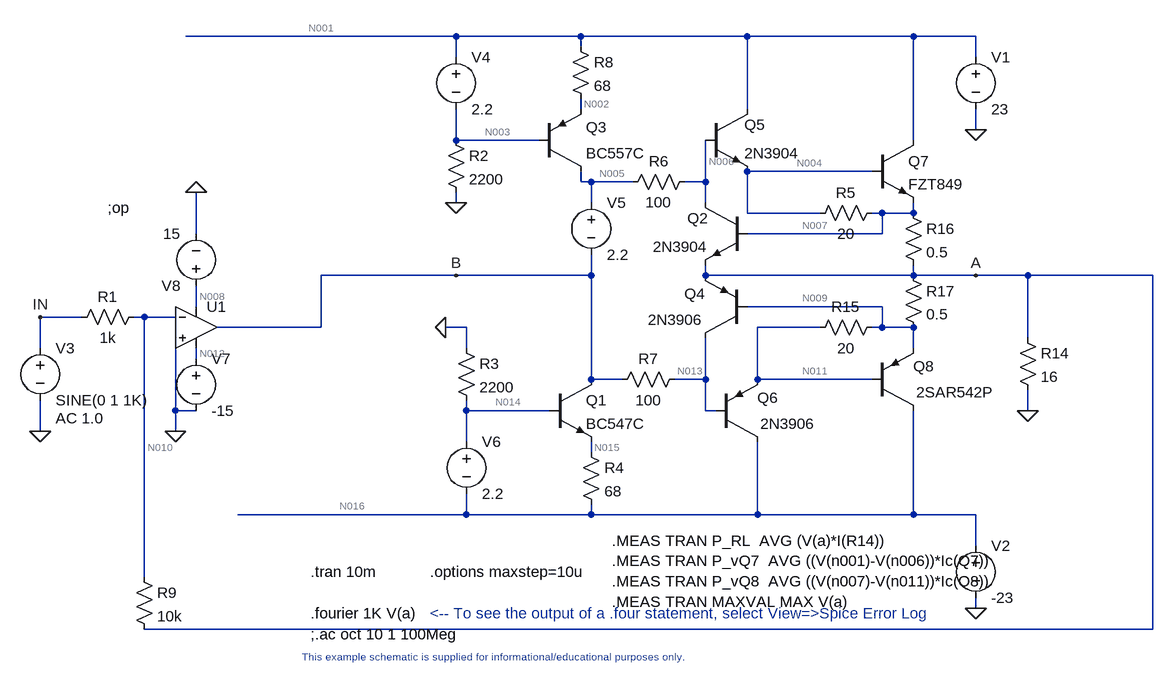
[diagram p0: schematic audioampFH2OP.asc]
audioampFH2OP.asc, the LTspice schematic file:
Version 4
SHEET 1 2516 2032
WIRE 1200 928 784 928
WIRE 1392 928 1200 928
WIRE 1648 928 1392 928
WIRE 1904 928 1648 928
WIRE 2000 928 1904 928
WIRE 1392 944 1392 928
WIRE 1200 960 1200 928
WIRE 2000 960 2000 928
WIRE 1392 1040 1392 1024
WIRE 1648 1040 1648 928
WIRE 2000 1072 2000 1040
WIRE 1200 1088 1200 1040
WIRE 1328 1088 1200 1088
WIRE 1904 1088 1904 928
WIRE 1840 1136 1648 1136
WIRE 1392 1152 1392 1136
WIRE 1408 1152 1392 1152
WIRE 1472 1152 1408 1152
WIRE 1584 1152 1584 1088
WIRE 1584 1152 1552 1152
WIRE 1200 1184 1200 1168
WIRE 1408 1184 1408 1152
WIRE 1584 1184 1584 1152
WIRE 1648 1200 1648 1136
WIRE 1760 1200 1648 1200
WIRE 1856 1200 1840 1200
WIRE 1904 1200 1904 1184
WIRE 1904 1200 1856 1200
WIRE 800 1232 800 1168
WIRE 1856 1232 1856 1200
WIRE 1856 1232 1648 1232
WIRE 1200 1296 992 1296
WIRE 1408 1296 1408 1264
WIRE 1408 1296 1200 1296
WIRE 1584 1296 1584 1280
WIRE 1904 1296 1904 1280
WIRE 1904 1296 1584 1296
WIRE 2000 1296 1904 1296
WIRE 2080 1296 2000 1296
WIRE 2272 1296 2080 1296
WIRE 800 1344 800 1312
WIRE 1856 1344 1648 1344
WIRE 624 1360 560 1360
WIRE 720 1360 704 1360
WIRE 768 1360 720 1360
WIRE 992 1376 992 1296
WIRE 992 1376 832 1376
WIRE 1216 1376 1184 1376
WIRE 1760 1376 1664 1376
WIRE 1856 1376 1856 1344
WIRE 1856 1376 1840 1376
WIRE 1904 1376 1856 1376
WIRE 2080 1392 2080 1296
WIRE 560 1408 560 1360
WIRE 1216 1408 1216 1376
WIRE 1904 1408 1904 1376
WIRE 800 1424 800 1408
WIRE 1408 1456 1408 1296
WIRE 1456 1456 1408 1456
WIRE 1584 1456 1584 1392
WIRE 1584 1456 1536 1456
WIRE 1664 1456 1664 1376
WIRE 1840 1456 1664 1456
WIRE 768 1504 768 1392
WIRE 800 1504 768 1504
WIRE 1216 1504 1216 1488
WIRE 1344 1504 1216 1504
WIRE 1584 1504 1584 1456
WIRE 1600 1504 1584 1504
WIRE 2080 1504 2080 1472
WIRE 560 1536 560 1488
WIRE 768 1536 768 1504
WIRE 1216 1552 1216 1504
WIRE 1408 1568 1408 1552
WIRE 1216 1664 1216 1632
WIRE 1216 1664 864 1664
WIRE 1408 1664 1408 1648
WIRE 1408 1664 1216 1664
WIRE 1664 1664 1664 1552
WIRE 1664 1664 1408 1664
WIRE 1904 1664 1904 1504
WIRE 1904 1664 1664 1664
WIRE 2000 1664 1904 1664
WIRE 2000 1712 2000 1664
WIRE 720 1760 720 1360
WIRE 2000 1808 2000 1792
WIRE 2272 1840 2272 1296
WIRE 2272 1840 720 1840
FLAG 2000 1072 0
FLAG 2000 1808 0
FLAG 2080 1504 0
FLAG 560 1536 0
FLAG 560 1360 IN
FLAG 1200 1184 0
FLAG 1184 1376 0
FLAG 2000 1296 A
FLAG 1200 1296 B
FLAG 768 1536 0
FLAG 800 1168 0
SYMBOL NPN 1584 1040 R0
WINDOW 0 60 24 Left 2
WINDOW 3 60 68 Left 2
SYMATTR InstName Q5
SYMATTR Value 2N3904
SYMBOL npn 1840 1088 R0
SYMATTR InstName Q7
SYMATTR Value FZT849
SYMBOL PNP 1600 1552 M180
WINDOW 0 64 68 Left 2
WINDOW 3 68 28 Left 2
SYMATTR InstName Q6
SYMATTR Value 2N3906
SYMBOL VOLTAGE 2000 944 R0
WINDOW 123 0 0 Left 2
WINDOW 39 0 0 Left 2
SYMATTR InstName V1
SYMATTR Value 23
SYMBOL voltage 2000 1696 R0
WINDOW 123 0 0 Left 2
WINDOW 39 0 0 Left 2
SYMATTR InstName V2
SYMATTR Value -23
SYMBOL res 2064 1376 R0
SYMATTR InstName R14
SYMATTR Value 16
SYMBOL pnp 1328 1136 M180
WINDOW 0 72 68 Left 2
WINDOW 3 72 28 Left 2
SYMATTR InstName Q3
SYMATTR Value BC557C
SYMBOL voltage 560 1392 R0
WINDOW 123 24 124 Left 2
WINDOW 39 0 0 Left 2
SYMATTR Value2 AC 1.0
SYMATTR InstName V3
SYMATTR Value SINE(0 1 1K)
SYMBOL res 720 1344 R90
WINDOW 0 0 56 VBottom 2
WINDOW 3 32 56 VTop 2
SYMATTR InstName R1
SYMATTR Value 1k
SYMBOL res 1376 928 R0
SYMATTR InstName R8
SYMATTR Value 68
SYMBOL PNP 1840 1504 M180
WINDOW 0 64 68 Left 2
WINDOW 3 68 28 Left 2
SYMATTR InstName Q8
SYMATTR Value 2SAR542P
SYMBOL res 1856 1360 R90
WINDOW 0 0 56 VBottom 2
WINDOW 3 32 56 VTop 2
SYMATTR InstName R15
SYMATTR Value 20
SYMBOL res 1888 1184 R0
SYMATTR InstName R16
SYMATTR Value 0.5
SYMBOL res 1888 1280 R0
SYMATTR InstName R17
SYMATTR Value 0.5
SYMBOL VOLTAGE 1200 944 R0
WINDOW 123 0 0 Left 2
WINDOW 39 0 0 Left 2
SYMATTR InstName V4
SYMATTR Value 2.2
SYMBOL res 1184 1072 R0
SYMATTR InstName R2
SYMATTR Value 2200
SYMBOL VOLTAGE 1408 1168 R0
WINDOW 123 0 0 Left 2
WINDOW 39 0 0 Left 2
SYMATTR InstName V5
SYMATTR Value 2.2
SYMBOL VOLTAGE 1216 1536 R0
WINDOW 123 0 0 Left 2
WINDOW 39 0 0 Left 2
SYMATTR InstName V6
SYMATTR Value 2.2
SYMBOL res 1200 1392 R0
SYMATTR InstName R3
SYMATTR Value 2200
SYMBOL res 1392 1552 R0
SYMATTR InstName R4
SYMATTR Value 68
SYMBOL npn 1344 1456 R0
SYMATTR InstName Q1
SYMATTR Value BC547C
SYMBOL res 1856 1184 R90
WINDOW 0 0 56 VBottom 2
WINDOW 3 32 56 VTop 2
SYMATTR InstName R5
SYMATTR Value 20
SYMBOL NPN 1648 1184 M0
WINDOW 0 60 24 Left 2
WINDOW 3 60 68 Left 2
SYMATTR InstName Q2
SYMATTR Value 2N3904
SYMBOL PNP 1648 1392 R180
WINDOW 0 64 68 Left 2
WINDOW 3 68 28 Left 2
SYMATTR InstName Q4
SYMATTR Value 2N3906
SYMBOL res 1568 1136 R90
WINDOW 0 0 56 VBottom 2
WINDOW 3 32 56 VTop 2
SYMATTR InstName R6
SYMATTR Value 100
SYMBOL res 1552 1440 R90
WINDOW 0 0 56 VBottom 2
WINDOW 3 32 56 VTop 2
SYMATTR InstName R7
SYMATTR Value 100
SYMBOL Opamps\\UniversalOpamp2 800 1376 R0
SYMATTR InstName U1
SYMBOL res 704 1744 R0
SYMATTR InstName R9
SYMATTR Value 10k
SYMBOL voltage 800 1408 R0
WINDOW 123 0 0 Left 2
WINDOW 39 0 0 Left 2
SYMATTR InstName V7
SYMATTR Value -15
SYMBOL voltage 800 1328 R180
WINDOW 123 0 0 Left 2
WINDOW 39 0 0 Left 2
SYMATTR InstName V8
SYMATTR Value 15
TEXT 976 1752 Left 2 !.tran 10m
TEXT 1160 1752 Left 2 !.options maxstep=10u
TEXT 976 1848 Left 2 !;.ac oct 10 1 100Meg
TEXT 1248 1872 Top 1 ;This example schematic is supplied for informational/educational purposes only.
TEXT 976 1816 Left 2 !.fourier 1K V(a)
TEXT 1160 1816 Left 2 ;<-- To see the output of a .four statement, select View=>Spice Error Log
TEXT 1440 1704 Left 2 !.MEAS TRAN P_RL  AVG (V(a)*I(R14))\n.MEAS TRAN P_vQ7  AVG ((V(n001)-V(n006))*Ic(Q7))\n.MEAS TRAN P_vQ8  AVG ((V(n007)-V(n011))*Ic(Q8))\n.MEAS TRAN MAXVAL MAX V(a)
TEXT 664 1192 Left 2 !;op

The netlist it stands for:
* audioampFH2OP.asc
Q5 N001 N006 N004 0 2N3904
Q7 N001 N004 N007 0 FZT849
Q6 N016 N013 N011 0 2N3906
V1 N001 0 23
V2 N016 0 -23
R14 A 0 16
Q3 N005 N003 N002 0 BC557C
V3 IN 0 SINE(0 1 1K) AC 1.0
R1 N010 IN 1k
R8 N001 N002 68
Q8 N016 N011 N009 0 2SAR542P
R15 N009 N011 20
R16 N007 A 0.5
R17 A N009 0.5
V4 N001 N003 2.2
R2 N003 0 2200
V5 N005 B 2.2
V6 N014 N016 2.2
R3 0 N014 2200
R4 N015 N016 68
Q1 B N014 N015 0 BC547C
R5 N007 N004 20
Q2 N006 N007 A 0 2N3904
Q4 N013 N009 A 0 2N3906
R6 N006 N005 100
R7 N013 B 100
XU1 0 N010 N008 N012 B level.2 Avol=1Meg GBW=10Meg Slew=10Meg ilimit=25m rail=0 Vos=0 phimargin=45 en=0 enk=0 in=0 ink=0 Rin=500Meg  ; pins IN+ IN- V+ V- OUT
R9 N010 A 10k
V7 N012 0 -15
V8 N008 0 15
.model NPN NPN
.model PNP PNP
.lib standard.bjt
.tran 10m
.options maxstep=10u
;.ac oct 10 1 100Meg
* This example schematic is supplied for informational/educational purposes only.
.fourier 1K V(a)
* <-- To see the output of a .four statement, select View=>Spice Error Log
.MEAS TRAN P_RL  AVG (V(a)*I(R14))
.MEAS TRAN P_vQ7  AVG ((V(n001)-V(n006))*Ic(Q7))
.MEAS TRAN P_vQ8  AVG ((V(n007)-V(n011))*Ic(Q8))
.MEAS TRAN MAXVAL MAX V(a)
;op
.lib UniversalOpamps2.sub
.backanno
.end

* Results of the author's LTspice run, read from the files saved beside the schematic
* Operating Point, zero values left out:
*   V(n001) = 23 V
*   V(n006) = 1.094 V
*   V(n004) = 365.4 mV
*   V(n007) = 8.924 mV
*   V(n016) = -23 V
*   V(n013) = -1.094 V
*   V(n011) = -365.3 mV
*   V(a) = 12.14 µV
*   V(n005) = 1.099 V
*   V(n003) = 20.8 V
*   V(n002) = 21.5 V
*   V(n010) = 1.104 µV
*   V(n009) = -8.899 mV
*   V(b) = -1.101 V
*   V(n014) = -20.8 V
*   V(n015) = -21.5 V
*   V(n008) = 15 V
*   V(n012) = -15 V
*   Ic(Q1) = 21.98 mA
*   Ib(Q1) = 39.08 µA
*   Ie(Q1) = -22.02 mA
*   Ic(Q8) = -1.477 µA
*   Ib(Q8) = -4.839 nA
*   Ie(Q8) = 1.482 µA
*   Ic(Q3) = -22.04 mA
*   Ib(Q3) = -30.66 µA
*   Ie(Q3) = 22.07 mA
*   Ic(Q4) = -1.099 pA
*   Ib(Q4) = 1.079 pA
*   Ic(Q6) = -17.75 mA
*   Ib(Q6) = -75.43 µA
*   Ie(Q6) = 17.82 mA
*   Ic(Q7) = 781.4 nA
*   Ib(Q7) = 6.511 nA
*   Ie(Q7) = -787.9 nA
*   Ic(Q2) = 1.099 pA
*   Ib(Q2) = -1.078 pA
*   Ic(Q5) = 17.77 mA
*   Ib(Q5) = 50.37 µA
*   Ie(Q5) = -17.82 mA
*   I(R9) = -1.104 nA
*   I(R7) = 75.43 µA
*   I(R6) = -50.37 µA
*   I(R5) = -17.82 mA
*   I(R4) = 22.02 mA
*   I(R3) = 9.455 mA
*   I(R2) = 9.455 mA
*   I(R17) = 17.82 mA
*   I(R16) = 17.82 mA
*   I(R15) = 17.82 mA
*   I(R8) = 22.07 mA
*   I(R1) = 1.104 nA
*   I(R14) = 758.9 nA
*   I(V8) = -1.454 mA
*   I(V7) = 1.536 mA
*   I(V6) = 9.415 mA
*   I(V5) = 21.99 mA
*   I(V4) = 9.424 mA
*   I(V3) = 1.104 nA
*   I(V2) = 49.18 mA
*   I(V1) = -49.27 mA
*   Ix(u1:3) = 1.454 mA
*   Ix(u1:4) = -1.536 mA
*   Ix(u1:5) = 82.16 µA
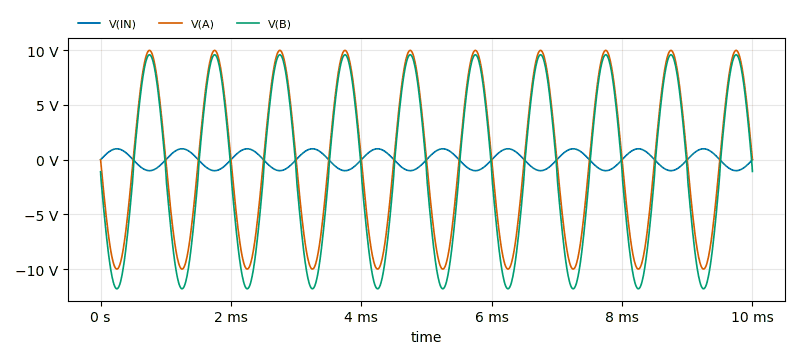
[diagram p1: Transient Analysis of audioampFH2OP.asc, plotted from the saved traces]
* Transient Analysis, 1 run:
*   V(IN): min -999 mV, max 999 mV, average 6.25 µV, rms 706.4 mV, last 0 V
*   V(A): min -9.99 V, max 9.99 V, average -51.02 µV, rms 7.064 V, last 18.54 mV
*   V(B): min -11.79 V, max 9.591 V, average -1.098 V, rms 7.699 V, last -1.069 V
* From the log:
*   N-Period=1
*   Fourier components of V(a)
*   DC component:6.05163e-006
*   Harmonic  Frequency   Fourier   Normalized   Phase    Normalized
*    Number     [Hz]     Component   Component  [degree]  Phase [deg]
*       1     1.000e+03  9.987e+00  1.000e+00    179.93°      0.00°
*       2     2.000e+03  1.256e-05  1.258e-06    -49.83°   -229.76°
*       3     3.000e+03  3.477e-04  3.482e-05    103.50°    -76.43°
*       4     4.000e+03  3.898e-06  3.903e-07    -37.47°   -217.41°
*       5     5.000e+03  3.608e-04  3.613e-05    109.95°    -69.98°
*       6     6.000e+03  7.108e-06  7.118e-07     59.52°   -120.41°
*       7     7.000e+03  3.769e-04  3.774e-05    113.08°    -66.85°
*       8     8.000e+03  1.310e-05  1.311e-06     84.46°    -95.48°
*       9     9.000e+03  3.940e-04  3.945e-05    112.98°    -66.95°
*   Total Harmonic Distortion: 0.007418%(0.000000%)
*   p_rl: AVG(v(a)*i(r14))=3.11677 FROM 0 TO 0.01
*   p_vq7: AVG((v(n001)-v(n006))*ic(q7))=2.42005 FROM 0 TO 0.01
*   p_vq8: AVG((v(n007)-v(n011))*ic(q8))=-0.172704 FROM 0 TO 0.01
*   maxval: MAX(v(a))=9.99002 FROM 0 TO 0.01